# Altium project Temp.PrjPcb (part 2 of 2)

## Sheet Frame Buffer.SchDoc
size A4
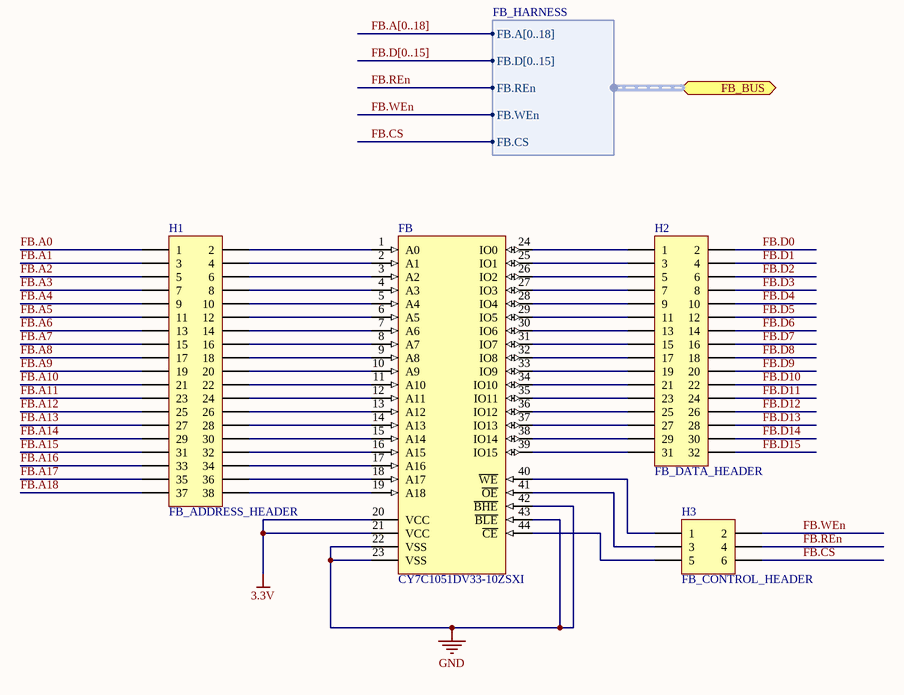
[diagram p16: Frame Buffer.SchDoc]

### Parts
FB  CY7C1051DV33-10ZSXI  [TSOP-44-SRAM]
H1  FB_ADDRESS_HEADER  [HDR2X19]
H2  FB_DATA_HEADER  [HDR2X16]
H3  FB_CONTROL_HEADER  [HDR2X3]

### Ports
FB_BUS (harness FB_HARNESS)

### Harnesses
FB_HARNESS: FB.A[0..18], FB.D[0..15], FB.REn, FB.WEn, FB.CS

### Nets
3.3V: FB.20(VCC) FB.21(VCC)
GND: FB.22(VSS) FB.23(VSS) FB.42(~{BHE}) FB.43(~{BLE})
FB.A0: H1.1
FB.A1: H1.3
FB.A2: H1.5
FB.A3: H1.7
FB.A4: H1.9
FB.A5: H1.11
FB.A6: H1.13
FB.A7: H1.15
FB.A8: H1.17
FB.A9: H1.19
FB.A10: H1.21
FB.A11: H1.23
FB.A12: H1.25
FB.A13: H1.27
FB.A14: H1.29
FB.A15: H1.31
FB.A16: H1.33
FB.A17: H1.35
FB.A18: H1.37
FB.CS: H3.6 ; port FB_BUS.FB.CS
FB.D0: H2.2
FB.D1: H2.4
FB.D2: H2.6
FB.D3: H2.8
FB.D4: H2.10
FB.D5: H2.12
FB.D6: H2.14
FB.D7: H2.16
FB.D8: H2.18
FB.D9: H2.20
FB.D10: H2.22
FB.D11: H2.24
FB.D12: H2.26
FB.D13: H2.28
FB.D14: H2.30
FB.D15: H2.32
FB.REn: H3.4 ; port FB_BUS.FB.REn
FB.WEn: H3.2 ; port FB_BUS.FB.WEn
NetFB_1: FB.1(A0) H1.2
NetFB_2: FB.2(A1) H1.4
NetFB_3: FB.3(A2) H1.6
NetFB_4: FB.4(A3) H1.8
NetFB_5: FB.5(A4) H1.10
NetFB_6: FB.6(A5) H1.12
NetFB_7: FB.7(A6) H1.14
NetFB_8: FB.8(A7) H1.16
NetFB_9: FB.9(A8) H1.18
NetFB_10: FB.10(A9) H1.20
NetFB_11: FB.11(A10) H1.22
NetFB_12: FB.12(A11) H1.24
NetFB_13: FB.13(A12) H1.26
NetFB_14: FB.14(A13) H1.28
NetFB_15: FB.15(A14) H1.30
NetFB_16: FB.16(A15) H1.32
NetFB_17: FB.17(A16) H1.34
NetFB_18: FB.18(A17) H1.36
NetFB_19: FB.19(A18) H1.38
NetFB_24: FB.24(IO0) H2.1
NetFB_25: FB.25(IO1) H2.3
NetFB_26: FB.26(IO2) H2.5
NetFB_27: FB.27(IO3) H2.7
NetFB_28: FB.28(IO4) H2.9
NetFB_29: FB.29(IO5) H2.11
NetFB_30: FB.30(IO6) H2.13
NetFB_31: FB.31(IO7) H2.15
NetFB_32: FB.32(IO8) H2.17
NetFB_33: FB.33(IO9) H2.19
NetFB_34: FB.34(IO10) H2.21
NetFB_35: FB.35(IO11) H2.23
NetFB_36: FB.36(IO12) H2.25
NetFB_37: FB.37(IO13) H2.27
NetFB_38: FB.38(IO14) H2.29
NetFB_39: FB.39(IO15) H2.31
NetFB_40: FB.40(~{WE}) H3.1
NetFB_41: FB.41(~{OE}) H3.3
NetFB_44: FB.44(~{CE}) H3.5

### Buses and harness runs
bus FB.A[0..18]
bus FB.D[0..15]

### Library data of the parts
FB = CY7C1051DV33-10ZSXI: pin to pad: 6>18 7>19 8>20 9>21 10>22 11>23 12>24 13>25 14>26 15>27 16>42 17>43 18>44 19>28 20>11 21>33 22>12 23>34 24>7 25>8 26>9 27>10 28>13 29>14 30>15 31>16 32>29 33>30 34>31 35>32 36>35 37>36 38>37 39>38 40>17 42>40 43>39 44>6
H1 = Header 19X2: Header, 19-Pin, Dual row; LatestRevisionDate: 17-Jul-2002; LatestRevisionNote: Re-released for DXP Platform.; Publisher: Altium Limited
H2 = Header 16X2: Header, 16-Pin, Dual row; LatestRevisionDate: 17-Jul-2002; LatestRevisionNote: Re-released for DXP Platform.; Publisher: Altium Limited
H3 = Header 3X2: Header, 3-Pin, Dual row; LatestRevisionDate: 17-Jul-2002; LatestRevisionNote: Re-released for DXP Platform.; Publisher: Altium Limited

## Nets that join several sheets
1.2V: FPGA_VCC (15 pins), Power Supply (C43.2 VR12.5)
3.3V: FPGA Bank 2 (R8.2 R9.2), Clocks (6 pins), EFM Power (21 pins), FPGA Config (R1.2), FPGA_VCC (57 pins), EFM (ARM_20.1 R10.1 R11.2), DAC (C46.2 C47.2 VREF.2), SRAM (SRAM1.20 SRAM1.21), Power Supply (C41.2 R3.2 VR33.3), Flash (FLASH1.7), JoystickButtons (6 pins), Frame Buffer (FB.20 FB.21)
A5V: DAC (C44.1 C45.1 DACX.2 DACY.2), Power Supply (C62.2 R2.2 VREG5.5)
AGND: EFM (H29.2), DAC (7 pins), Power Supply (5 pins)
GND: FPGA Bank 0 (FPGA.D4), Clocks (9 pins), EFM Power (23 pins), FPGA Config (8 pins), FPGA_VCC (25 pins), FPGA Ground (37 pins), EFM (12 pins), DAC (10 pins), SRAM (SRAM1.22 SRAM1.23 SRAM1.42 SRAM1.43), Power Supply (12 pins), Flash (FLASH1.8), HDMI (6 pins), JoystickButtons (ZOOM_IN.2 ZOOM_IN.4 ZOOM_OUT.2 ZOOM_OUT.4), Frame Buffer (FB.22 FB.23 FB.42 FB.43)
EBI.A0: FPGA Bank 1 (FPGA.F15), EFM (EFM32.J4)
EBI.A1: FPGA Bank 1 (FPGA.F16), EFM (EFM32.K3)
EBI.A2: FPGA Bank 1 (FPGA.C17), EFM (EFM32.L3)
EBI.A3: FPGA Bank 1 (FPGA.C18), EFM (EFM32.J7)
EBI.A4: FPGA Bank 1 (FPGA.F14), EFM (EFM32.J8)
EBI.A5: FPGA Bank 1 (FPGA.G14), EFM (EFM32.G10)
EBI.A6: FPGA Bank 1 (FPGA.D17), EFM (EFM32.G11)
EBI.A7: FPGA Bank 1 (FPGA.D18), EFM (EFM32.E9)
EBI.A8: FPGA Bank 1 (FPGA.H12), EFM (EFM32.E10)
EBI.A9: FPGA Bank 1 (FPGA.G13), EFM (EFM32.F10)
EBI.A10: FPGA Bank 1 (FPGA.E16), EFM (EFM32.E11)
EBI.A11: FPGA Bank 1 (FPGA.E18), EFM (EFM32.A9)
EBI.A12: FPGA Bank 1 (FPGA.K12), EFM (EFM32.B9)
EBI.A13: FPGA Bank 1 (FPGA.K13), EFM (EFM32.C9)
EBI.A14: FPGA Bank 1 (FPGA.F17), EFM (EFM32.D9)
EBI.A15: FPGA Bank 1 (FPGA.F18), EFM (EFM32.D10)
EBI.A16: FPGA Bank 1 (FPGA.H13), EFM (EFM32.E4)
EBI.A17: FPGA Bank 1 (FPGA.H14), EFM (EFM32.F1)
EBI.A18: FPGA Bank 1 (FPGA.H15), EFM (EFM32.F2)
EBI.A19: FPGA Bank 1 (FPGA.H16), EFM (EFM32.F3)
EBI.A20: FPGA Bank 1 (FPGA.G16), EFM (EFM32.F4)
EBI.A21: FPGA Bank 1 (FPGA.G18), EFM (EFM32.G1)
EBI.A22: FPGA Bank 1 (FPGA.J13), EFM (EFM32.G2)
EBI.CS0: EFM (EFM32.D6), SRAM (H6.6)
EBI.CS1: FPGA Bank 1 (FPGA.N18), EFM (EFM32.A5)
EBI.D0: FPGA Bank 1 (FPGA.K14), EFM (EFM32.B4), SRAM (H5.2)
EBI.D1: FPGA Bank 1 (FPGA.L12), EFM (EFM32.A4), SRAM (H5.4)
EBI.D2: FPGA Bank 1 (FPGA.L13), EFM (EFM32.C3), SRAM (H5.6)
EBI.D3: FPGA Bank 1 (FPGA.K15), EFM (EFM32.B3), SRAM (H5.8)
EBI.D4: FPGA Bank 1 (FPGA.K16), EFM (EFM32.A3), SRAM (H5.10)
EBI.D5: FPGA Bank 1 (FPGA.L15), EFM (EFM32.B2), SRAM (H5.12)
EBI.D6: FPGA Bank 1 (FPGA.L16), EFM (EFM32.A2), SRAM (H5.14)
EBI.D7: FPGA Bank 1 (FPGA.H17), EFM (EFM32.A1), SRAM (H5.16)
EBI.D8: FPGA Bank 1 (FPGA.H18), EFM (EFM32.B1), SRAM (H5.18)
EBI.D9: FPGA Bank 1 (FPGA.J16), EFM (EFM32.C2), SRAM (H5.20)
EBI.D10: FPGA Bank 1 (FPGA.J18), EFM (EFM32.C1), SRAM (H5.22)
EBI.D11: FPGA Bank 1 (FPGA.K17), EFM (EFM32.D2), SRAM (H5.24)
EBI.D12: FPGA Bank 1 (FPGA.K18), EFM (EFM32.D1), SRAM (H5.26)
EBI.D13: FPGA Bank 1 (FPGA.L17), EFM (EFM32.E3), SRAM (H5.28)
EBI.D14: FPGA Bank 1 (FPGA.L18), EFM (EFM32.E2), SRAM (H5.30)
EBI.D15: FPGA Bank 1 (FPGA.M16), EFM (EFM32.E1), SRAM (H5.32)
EBI.REn: FPGA Bank 1 (FPGA.N17), EFM (EFM32.A7), SRAM (H6.4)
EBI.WEn: FPGA Bank 1 (FPGA.M18), EFM (EFM32.B6), SRAM (H6.2)
EFM_CLK: FPGA Bank 2 (FPGA.R15), EFM (EFM32.J9), Flash (H10.7)
EFM_RX: FPGA Bank 2 (FPGA.R13), EFM (EFM32.K11), Flash (H10.3)
FB.A0: FPGA Bank 3 (FPGA.N4), Frame Buffer (H1.1)
FB.A1: FPGA Bank 3 (FPGA.N3), Frame Buffer (H1.3)
FB.A2: FPGA Bank 3 (FPGA.P4), Frame Buffer (H1.5)
FB.A3: FPGA Bank 3 (FPGA.P3), Frame Buffer (H1.7)
FB.A4: FPGA Bank 3 (FPGA.L6), Frame Buffer (H1.9)
FB.A5: FPGA Bank 3 (FPGA.M5), Frame Buffer (H1.11)
FB.A6: FPGA Bank 3 (FPGA.U2), Frame Buffer (H1.13)
FB.A7: FPGA Bank 3 (FPGA.U1), Frame Buffer (H1.15)
FB.A8: FPGA Bank 3 (FPGA.T2), Frame Buffer (H1.17)
FB.A9: FPGA Bank 3 (FPGA.T1), Frame Buffer (H1.19)
FB.A10: FPGA Bank 3 (FPGA.P2), Frame Buffer (H1.21)
FB.A11: FPGA Bank 3 (FPGA.P1), Frame Buffer (H1.23)
FB.A12: FPGA Bank 3 (FPGA.N2), Frame Buffer (H1.25)
FB.A13: FPGA Bank 3 (FPGA.N1), Frame Buffer (H1.27)
FB.A14: FPGA Bank 3 (FPGA.M3), Frame Buffer (H1.29)
FB.A15: FPGA Bank 3 (FPGA.M1), Frame Buffer (H1.31)
FB.A16: FPGA Bank 3 (FPGA.L2), Frame Buffer (H1.33)
FB.A17: FPGA Bank 3 (FPGA.L1), Frame Buffer (H1.35)
FB.A18: FPGA Bank 3 (FPGA.K2), Frame Buffer (H1.37)
FB.CS: FPGA Bank 3 (FPGA.J6), Frame Buffer (H3.6)
FB.D0: FPGA Bank 3 (FPGA.K1), Frame Buffer (H2.2)
FB.D1: FPGA Bank 3 (FPGA.L4), Frame Buffer (H2.4)
FB.D2: FPGA Bank 3 (FPGA.L3), Frame Buffer (H2.6)
FB.D3: FPGA Bank 3 (FPGA.J3), Frame Buffer (H2.8)
FB.D4: FPGA Bank 3 (FPGA.J1), Frame Buffer (H2.10)
FB.D5: FPGA Bank 3 (FPGA.H2), Frame Buffer (H2.12)
FB.D6: FPGA Bank 3 (FPGA.H1), Frame Buffer (H2.14)
FB.D7: FPGA Bank 3 (FPGA.K4), Frame Buffer (H2.16)
FB.D8: FPGA Bank 3 (FPGA.K3), Frame Buffer (H2.18)
FB.D9: FPGA Bank 3 (FPGA.L5), Frame Buffer (H2.20)
FB.D10: FPGA Bank 3 (FPGA.K5), Frame Buffer (H2.22)
FB.D11: FPGA Bank 3 (FPGA.H4), Frame Buffer (H2.24)
FB.D12: FPGA Bank 3 (FPGA.H3), Frame Buffer (H2.26)
FB.D13: FPGA Bank 3 (FPGA.L7), Frame Buffer (H2.28)
FB.D14: FPGA Bank 3 (FPGA.K6), Frame Buffer (H2.30)
FB.D15: FPGA Bank 3 (FPGA.G3), Frame Buffer (H2.32)
FB.REn: FPGA Bank 3 (FPGA.J7), Frame Buffer (H3.4)
FB.WEn: FPGA Bank 3 (FPGA.G1), Frame Buffer (H3.2)
FPGAB.CLK+: FPGA Bank 0 (FPGA.B2), HDMI (H11.13)
FPGAB.CLK-: FPGA Bank 0 (FPGA.A2), HDMI (H11.15)
FPGAB.D0+: FPGA Bank 0 (FPGA.B6), HDMI (H11.9)
FPGAB.D0-: FPGA Bank 0 (FPGA.A6), HDMI (H11.11)
FPGAB.D1+: FPGA Bank 0 (FPGA.B4), HDMI (H11.5)
FPGAB.D1-: FPGA Bank 0 (FPGA.A4), HDMI (H11.7)
FPGAB.D2+: FPGA Bank 0 (FPGA.B3), HDMI (H11.1)
FPGAB.D2-: FPGA Bank 0 (FPGA.A3), HDMI (H11.3)
GPIO.0: FPGA Bank 2 (H31.2), EFM (EFM32.H4)
GPIO.1: FPGA Bank 2 (H31.4), EFM (EFM32.H5)
GPIO.2: FPGA Bank 2 (H31.6), EFM (EFM32.J5)
GPIO.3: FPGA Bank 2 (H31.8), EFM (EFM32.J6)
GPIO.4: FPGA Bank 2 (H31.10), EFM (EFM32.K5)
NetEFM32_C4: EFM (EFM32.C4), JoystickButtons (H21.1)
NetEFM32_C5: EFM (EFM32.C5), JoystickButtons (H20.2)
NetEFM32_C10: FPGA Config (JTAG.1), EFM (EFM32.C10 R10.2)
NetEFM32_C11: EFM (EFM32.C11), DAC (H30.1)
NetEFM32_H1: EFM (EFM32.H1), JoystickButtons (H19.2)
NetEFM32_H2: EFM (EFM32.H2), JoystickButtons (H19.6)
NetEFM32_H8: FPGA Bank 2 (H33.2), EFM (EFM32.H8 R11.1)
NetEFM32_J1: EFM (EFM32.J1), JoystickButtons (H19.4)
NetEFM32_J2: EFM (EFM32.J2), JoystickButtons (H19.8)
NetEFM32_K2: EFM (EFM32.K2), JoystickButtons (H19.10)
NetEFM32_L1: Clocks (H26.2), EFM (EFM32.L1)
NetEFM32_L2: EFM (EFM32.L2), JoystickButtons (H19.12)
NetEFM32_L5: EFM (EFM32.L5), DAC (H24.2)
NetEFM32_L6: EFM (EFM32.L6), DAC (H25.2)
NetEFM32_L9: Clocks (H27.2), EFM (EFM32.L9)
NetFPGA_A8: FPGA Bank 0 (FPGA.A8), DAC (VREF.3)
NetFPGA_A11: FPGA Bank 0 (FPGA.A11), DAC (H15.5)
NetFPGA_A12: FPGA Bank 0 (FPGA.A12), DAC (H15.7)
NetFPGA_B11: FPGA Bank 0 (FPGA.B11), DAC (H15.1)
NetFPGA_B12: FPGA Bank 0 (FPGA.B12), DAC (H15.3)
NetFPGA_T10: FPGA Bank 2 (FPGA.T10), Clocks (H28.2)
NetH14_1: Power Supply (H16.2 H17.3 H18.3 H23.1), HDMI (H14.1)
SPI.CS: EFM (EFM32.J10), Flash (H10.5)
SPI.TX: EFM (EFM32.L11), Flash (H10.1)